# Altium project Monitoring_Control_Circuit.PrjPcb
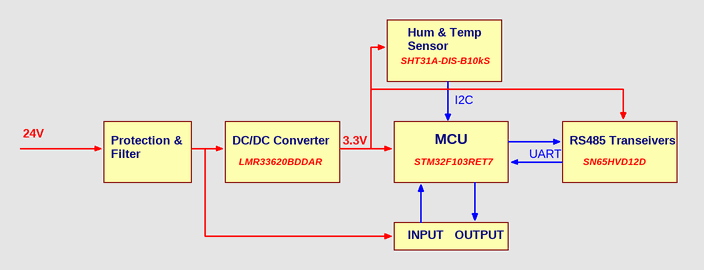
[diagram p0: 00_Diagram.SchDoc]
7 sheets, 118 parts. Net scope: flat (ports and power ports of the same name join across sheets).
Board file: Monitoring_Control_Circuit.PcbDoc
Sheets:
  00_Diagram.SchDoc
  01_MCU.SchDoc
  02_Hum_Temp_Sensor.SchDoc
  03_RS485.SchDoc
  04_ADC.SchDoc
  05_Power.SchDoc
  06_Input_Output.SchDoc

## Sheet 00_Diagram.SchDoc: Block Diagram
size A4; Project_Name: Monitoring_Control_Circuit; Designer: Hao Thai; Version: 1.0

### Notes on the sheet
- Hum & Temp
- SHT31A-DIS-B10kS
- Sensor
- I2C
- 24V
- Protection &
- Filter
- DC/DC Converter
- LMR33620BDDAR
- 3.3V
- STM32F103RET7
- MCU
- UART
- RS485 Transeivers
- SN65HVD12D
- INPUT
- OUTPUT
- Document Title:
- Size:
- Project Name:
- A4
- Designer:
- Reviewer:
- Revision:
- Sheet
- of
- Nguyen Xien Street
- Long Thanh My Ward, Thu Duc District
- Ho Chi Minh City
- Date:
- File:

## Sheet 01_MCU.SchDoc: MCU
size A4; Project_Name: Monitoring_Control_Circuit; Designer: Hao Thai; Version: 1.0
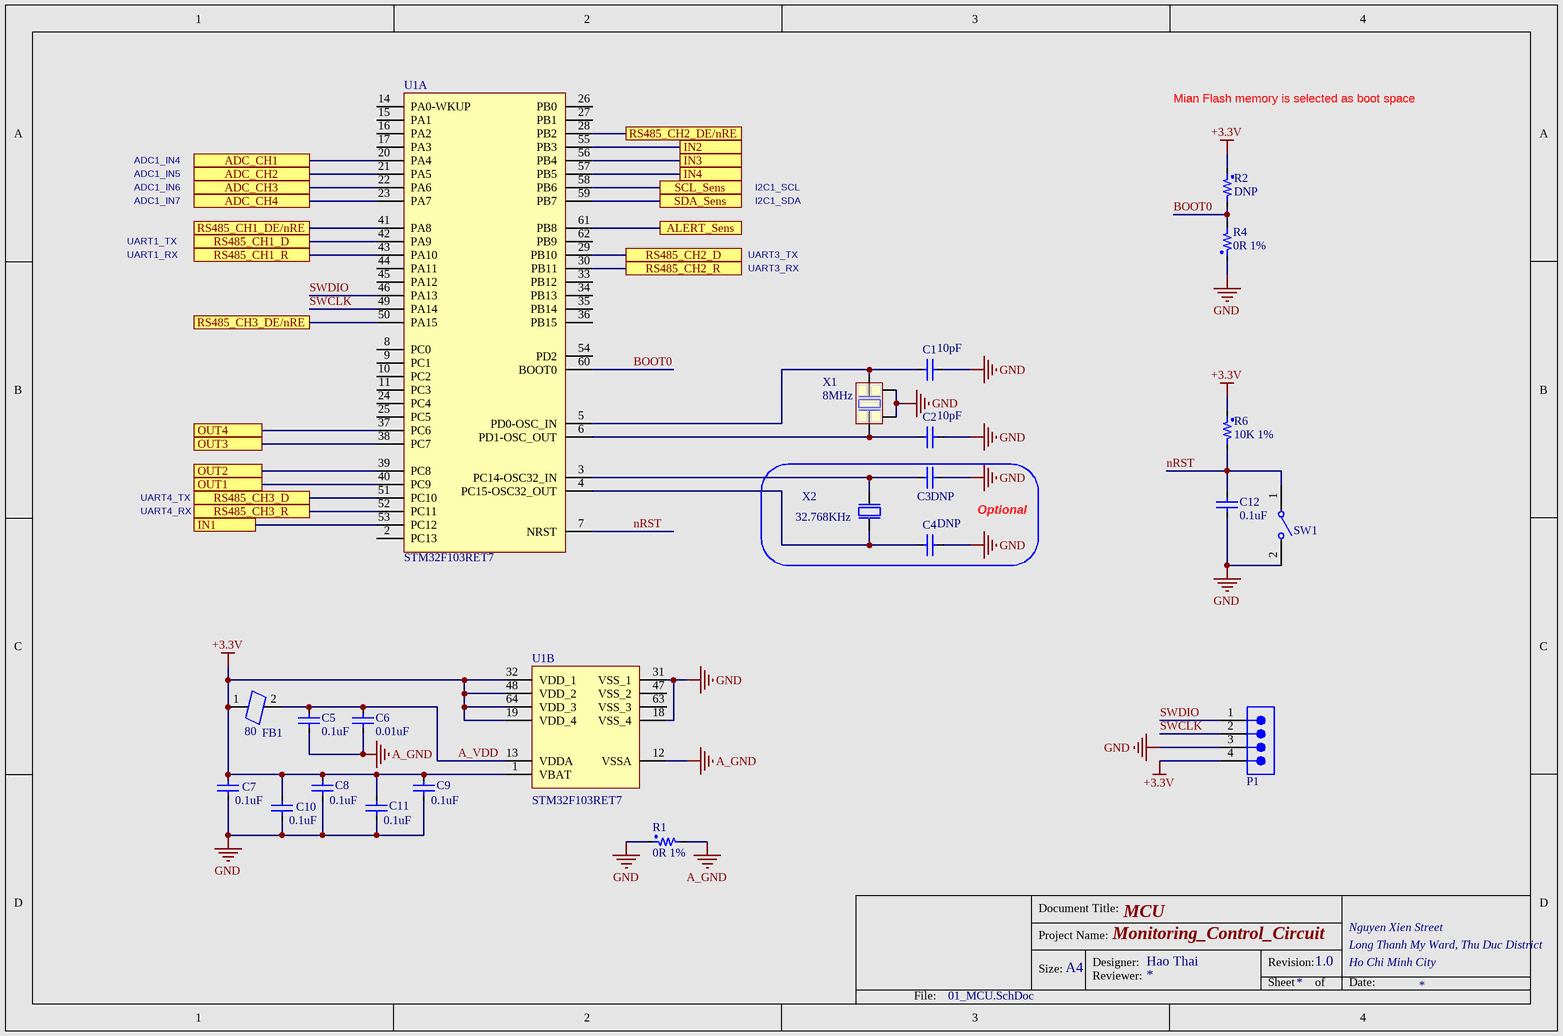
[diagram p1: 01_MCU.SchDoc]

### Parts
C1  10pF  [C0603 (1608 metric)]
C2  10pF  [C0603 (1608 metric)]
C3  DNP  [C0603 (1608 metric)]  (no BOM)
C4  DNP  [C0603 (1608 metric)]  (no BOM)
C5  0.1uF  [C0603 (1608 metric)]
C6  0.01uF  [C0603 (1608 metric)]
C7  0.1uF  [C0603 (1608 metric)]
C8  0.1uF  [C0603 (1608 metric)]
C9  0.1uF  [C0603 (1608 metric)]
C10  0.1uF  [C0603 (1608 metric)]
C11  0.1uF  [C0603 (1608 metric)]
C12  0.1uF  [C0603 (1608 metric)]
FB1  80  [FB0805 (2012 METRIC)]
P1  61300411121  [61300411121]  (value not drawn)
R1  0R 1%  [R0603 (1608 Metric)]
R2  DNP  [R0603 (1608 Metric)]  (no BOM)
R4  0R 1%  [R0603 (1608 Metric)]
R6  10K 1%  [R0603 (1608 Metric)]
SW1  434121025816  [WS-TASV_L6W3.8H2.5_4341x10258x6]  (value not drawn)
U1  STM32F103RET7  [STM-LQFP64_N]  (parts A,B of 2)
X1  8MHz  [TSX_3225]
X2  32.768KHz  [XTAL_3215_2Pin]  (no BOM)

### Blocks framed on the sheet
Optional: C3 C4 X2

### Ports
ADC_CH1, ADC_CH2, ADC_CH3, ADC_CH4, ALERT_Sens, IN1, IN2, IN3, IN4, OUT1, OUT2, OUT3, OUT4, RS485_CH1_D, RS485_CH1_DE/nRE, RS485_CH1_R, RS485_CH2_D, RS485_CH2_DE/nRE, RS485_CH2_R, RS485_CH3_D, RS485_CH3_DE/nRE, RS485_CH3_R, SCL_Sens, SDA_Sens

### Nets
+3.3V: C7.2 C8.2 C9.2 C10.2 C11.2 FB1.1 P1.4 R2.1 R6.1 U1.1(VBAT) U1.19(VDD_4) U1.32(VDD_1) U1.48(VDD_2) U1.64(VDD_3)
A_GND: C5.1 C6.1 R1.2 U1.12(VSSA)
GND: C1.1 C2.1 C3.2 C4.2 C7.1 C8.1 C9.1 C10.1 C11.1 C12.2 P1.3 R1.1 R4.1 SW1.2 U1.18(VSS_4) U1.31(VSS_1) X1.2(GND) X1.4(GND)
A_VDD: C5.2 C6.2 FB1.2 U1.13(VDDA)
ADC_CH1: U1.20(PA4) ; port ADC_CH1
ADC_CH2: U1.21(PA5) ; port ADC_CH2
ADC_CH3: U1.22(PA6) ; port ADC_CH3
ADC_CH4: U1.23(PA7) ; port ADC_CH4
ALERT_Sens: U1.61(PB8) ; port ALERT_Sens
BOOT0: R2.2 R4.2 U1.60(BOOT0)
IN1: U1.53(PC12) ; port IN1
IN2: U1.55(PB3) ; port IN2
IN3: U1.56(PB4) ; port IN3
IN4: U1.57(PB5) ; port IN4
nRST: C12.1 R6.2 SW1.1 U1.7(NRST)
OUT1: U1.40(PC9) ; port OUT1
OUT2: U1.39(PC8) ; port OUT2
OUT3: U1.38(PC7) ; port OUT3
OUT4: U1.37(PC6) ; port OUT4
RS485_CH1_D: U1.42(PA9) ; port RS485_CH1_D
RS485_CH1_DE/nRE: U1.41(PA8) ; port RS485_CH1_DE/nRE
RS485_CH1_R: U1.43(PA10) ; port RS485_CH1_R
RS485_CH2_D: U1.29(PB10) ; port RS485_CH2_D
RS485_CH2_DE/nRE: U1.28(PB2) ; port RS485_CH2_DE/nRE
RS485_CH2_R: U1.30(PB11) ; port RS485_CH2_R
RS485_CH3_D: U1.51(PC10) ; port RS485_CH3_D
RS485_CH3_DE/nRE: U1.50(PA15) ; port RS485_CH3_DE/nRE
RS485_CH3_R: U1.52(PC11) ; port RS485_CH3_R
SCL_Sens: U1.58(PB6) ; port SCL_Sens
SDA_Sens: U1.59(PB7) ; port SDA_Sens
SWCLK: P1.2 U1.49(PA14)
SWDIO: P1.1 U1.46(PA13)
NetC1_2: C1.2 U1.5(PD0-OSC_IN) X1.1(Input)
NetC2_2: C2.2 U1.6(PD1-OSC_OUT) X1.3(Out)
NetC3_1: C3.1 U1.3(PC14-OSC32_IN) X2.2(out)
NetC4_1: C4.1 U1.4(PC15-OSC32_OUT) X2.1(inp)

Not connected (* = marked no-connect by the designer): U1 2(PC13) 8(PC0) 9(PC1) 10(PC2) 11(PC3) 14(PA0-WKUP) 15(PA1) 16(PA2) 17(PA3) 24(PC4) 25(PC5) 26(PB0) 27(PB1) 33(PB12) 34(PB13) 35(PB14) 36(PB15) 44(PA11) 45(PA12) 47(VSS_2) 54(PD2) 62(PB9) 63(VSS_3)

### Notes on the sheet
- Mian Flash memory is selected as boot space
- ADC1_IN4
- ADC1_IN5
- UART1_TX
- ADC1_IN6
- ADC1_IN7
- I2C1_SCL
- I2C1_SDA
- UART1_RX
- UART3_TX
- UART3_RX
- UART4_TX
- UART4_RX
- Document Title:
- Size:
- Project Name:
- A4
- Designer:
- Reviewer:
- Revision:
- Sheet
- of
- Nguyen Xien Street
- Long Thanh My Ward, Thu Duc District
- Ho Chi Minh City
- Date:
- File:

### Library data of the parts
C1 C2 = CC0603JRNPO9BN100: Multilayer Ceramic Capacitors MLCC - SMD/SMT 10pF 250V C0G +/-5% 0603; Mfr: Yageo; Dielectric: C0G (NP0); Voltage: 50V; Tolerance: 5%; Mfr Part Number: CC0603JRNPO9BN100; Supplier Part Number 1: 603-CC603JRNPO9BN100; Supplier 1: Mouser; Value: 10pF; Case: 0603 (1608 metric)
C3 C4 = CC0603JRNPO9BN120: Multilayer Ceramic Capacitors MLCC - SMD/SMT 12pF 250V C0G +/-5% 0603; Mfr: Yageo; Dielectric: C0G (NP0); Voltage: 50V; Tolerance: 5%; Mfr Part Number: CC0603JRNPO9BN120; Supplier Part Number 1: 603-CC603JRNPO9BN120; Supplier 1: Mouser; Value: 12pF; Case: 0603 (1608 metric)
C5 C7-C12 = CC0603KRX7R9BB104: Multilayer Ceramic Capacitors MLCC - SMD/SMT 0.1uF 50V X7R +/-10% 0603; Mfr: Yageo; Tolerance: 10%; Mfr Part Number: CC0603KRX7R9BB104; Supplier Part Number 1: 603-CC603KRX7R9BB104; Supplier 1: Mouser; Value: 0.1uF; Dielectric: X7R; Case: 0603 (1608 metric); Voltage: 50V
C6 = CC0603KRX7R9BB103: Multilayer Ceramic Capacitors MLCC - SMD/SMT 0.01uF 50V X7R +/-10% 0603; Mfr: Yageo; Tolerance: 10%; Mfr Part Number: CC0603KRX7R9BB103; Supplier Part Number 1: 603-CC603KRX7R9BB103; Supplier 1: Mouser; Value: 0.01uF; Dielectric: X7R; Case: 0603 (1608 metric); Voltage: 50V
FB1 = FBMH2012HM800-T: Ferrite Beads HI CUR CHIP BD 0805 80OHMS 25%; Mfr: Taiyo Yuden; Maximum DC Resistance: 25 mOhm; Maximum DC Current: 2.7A; Impedance: 80; Supplier Part Number 1: 963-FBMH2012HM800-T; Mfr Part Number: FBMH2012HM800-T; Supplier 1: Mouser; Tolerance: 25%; Package: 0805 (2012 metric)
P1 = 61300411121: WR-PHD Pin Header, THT, Vertical, pitch 2.54mm, 1 Row, 4P; Mfr: Wurth Elektronik; Contact Resistance: 20mΩ; Rated Current: 3A; Working Voltage: 250V; Withstanding Voltage: 500V; ComponentLink1Description: Website Link; ComponentLink1URL: https://www.we-online.com/redexpert/article/61300411121?ad; ComponentLink2Description: Datasheet Link; ComponentLink2URL: https://www.we-online.com/redexpert/spec/61300411121?ad; Mfr Part Number: 61300411121; Category: Board-to-Board Connectors; Match Code: WR-PHD; Mount: Through Hole; Operating Temperature Max: 105°C; Operating Temperature Min: -40°C; Packaging: Bag; Gender: Pin Header; Number of Pins: 4; Number of Rows: 1; Orientation: Vertical; Pitch: 2.54mm
R1 R4 = RC0603FR-070RL: Thick Film Resistors - SMD 0 OHM 1% Case 0603; Mfr: Yageo; Value: 0R; Supplier 1: Mouser; Supplier Part Number 1: 603-RC0603FR-070RL; Mfr Part Number: RC0603FR-070RL; Case: 0603 (1608 metric); Tolerance: 1%
R2 R6 = RC0603FR-0710KL: Thick Film Resistors - SMD 10K OHM 1% Case 0603; Mfr: Yageo; Value: 10K; Supplier 1: Mouser; Supplier Part Number 1: 603-RC0603FR-0710KL; Mfr Part Number: RC0603FR-0710KL; Case: 0603 (1608 metric); Tolerance: 1%
SW1 = 434121025816: WS-TASV SMT Tact Switch, SPST-NO, 12VDC, 50mA, 160g; Mfr: Wurth Elektronik; Washable: No; ComponentLink1Description: Website Link; ComponentLink1URL: https://www.we-online.com/redexpert/article/434121025816?ad; ComponentLink2Description: Datasheet Link; ComponentLink2URL: https://www.we-online.com/redexpert/spec/434121025816?ad; Mfr Part Number: 434121025816; Category: Tact Switches; Match Code: WS-TASV; Mount: Surface Mount; Operating Temperature Max: 85°C; Operating Temperature Min: -40°C; Packaging: Tape and Reel; Length: 6mm; Width: 3.8mm; Height: 2.5mm; Circuit: SPST-NO; Contact Material: Stainless Steel; Contact Plating: Silver; Operation Force: 160g; Rated Current: 50mA; Rated Voltage: 12VDC; Terminal Material: Copper Alloy; Terminal Plating: Silver
U1 = STM32F103RET7: ARM Cortex-M3 32-bit MCU, 512 KB Flash, 64 KB Internal RAM, 51 I/Os, 64-pin LQFP, -40 to 105 degC, Tray; Mfr: STMicroelectronics; DatasheetVersion: Rev. 8; PackageVersion: Rev. 4, 06/2013; PackageReference: LQFP64; PackageDescription: 64-Pin Low Profile Quad Flat Package, 10 x 10 mm Body, 0.5 mm Pitch; Supplier 1: Mouser; Supplier Part Number 1: 511-STM32F103RET7; ComponentLink1Description: Manufacturer URL; ComponentLink1URL: http://www.st.com/web/en/home.html; ComponentLink2Description: Datasheet; ComponentLink2URL: http://www.st.com/st-web-ui/static/active/en/resource/technical/document/datasheet/CD00191185.pdf; ComponentLink3Description: Package Specification; ComponentLink3URL: http://www.st.com/st-web-ui/static/active/en/resource/technical/document/datasheet/DM00037051.pdf; Mfr Part Number: STM32F103RET7
X1 = ECS-80-10-33-CHN-TR: Crystals CRYSTAL 8.0000MHZ 10PF SMD,ECX-32,+/-10ppm,+/-25ppm,400 Ohm,Fundamental,-40 C 85 C,4-SMD, No Lead; Mfr: ECS; Tolerance: 10 PPM; Frequency Stability: 20ppm; Value: 8MHz; Mfr Part Number: ECS-80-10-33-CHN-TR; Supplier 1: Mouser; Load Capacitance: 10 pF; Supplier Part Number 1: 520-ECS-80-1033CHNTR; Package: 3.2 mm x 2.5 mm
X2 = ECS-.327-12.5-34B-TR: Crystals 32.768KHz 20ppm 12.5pF -40C +85C; Mfr: ECS; Mfr Part Number: ECS-.327-12.5-34B-TR; Pin Count: 2; Value: 32.768KHz; Package: 3.2 mm x 1.5 mm; Supplier 1: Mouser; Supplier Part Number 1: 520-327-12.5-34B; Tolerance: 20 ppm

## Sheet 02_Hum_Temp_Sensor.SchDoc: Hum_Temp_Sensor
size A4; SheetNumber: 3; SheetTotal: 7; Project_Name: Monitoring_Control_Circuit; Designer: Hao Thai; Version: 1.0
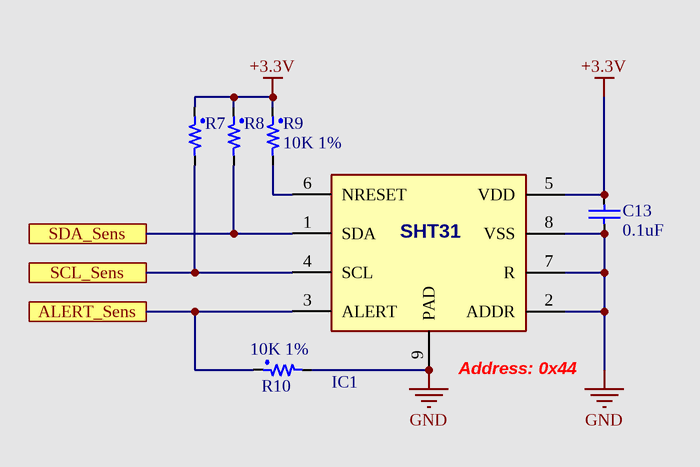
[diagram p2: 02_Hum_Temp_Sensor.SchDoc]

### Parts
C13  0.1uF  [C0603 (1608 metric)]
IC1  SHT31A-DIS-B10kS  [SHT31]  (value not drawn)
R7  10K 1%  [R0603 (1608 Metric)]  (value not drawn)
R8  10K 1%  [R0603 (1608 Metric)]  (value not drawn)
R9  10K 1%  [R0603 (1608 Metric)]
R10  10K 1%  [R0603 (1608 Metric)]

### Ports
ALERT_Sens, SCL_Sens, SDA_Sens

### Nets
+3.3V: C13.2 IC1.5(VDD) R7.1 R8.1 R9.1
GND: C13.1 IC1.2(ADDR) IC1.7(R) IC1.8(VSS) IC1.9(PAD) R10.2
ALERT_Sens: IC1.3(ALERT) R10.1 ; port ALERT_Sens
SCL_Sens: IC1.4(SCL) R7.2 ; port SCL_Sens
SDA_Sens: IC1.1(SDA) R8.2 ; port SDA_Sens
NetIC1_6: IC1.6(NRESET) R9.2

### Notes on the sheet
- (near IC1) Address: 0x44
- Document Title:
- BK Maker Club
- Size:
- Project Name:
- A4
- Designer:
- Reviewer:
- Revision:
- Sheet
- of
- Nguyen Xien Street
- Long Thanh My Ward, Thu Duc District
- Ho Chi Minh City
- Date:
- File:
- (in symbol SHT31A-DIS-B10kS) SHT31

### Library data of the parts
C13 = CC0603KRX7R9BB104: as C5 on sheet 01_MCU; Mfr Part Number: CC0603KRX7R9BB104; Supplier Part Number 1: 603-CC603KRX7R9BB104; Supplier 1: Mouser; Value: 0.1uF; Dielectric: X7R; Case: 0603 (1608 metric); Voltage: 50V
IC1 = SHT31A-DIS-B10kS: Board Mount Humidity Sensors RH/ T Sensor, Automotive certified; Mfr: Sensirion; Datasheet Link: http://www.farnell.com/datasheets/2915263.pdf; Height: 1mm; Mfr Part Number: SHT31A-DIS-B10kS; Supplier Part Number 1: 403-SHT31ADIS-B10KS; Supplier 1: Mouser; Arrow Part Number: SHT31A-DIS-B10KS; Arrow Price/Stock: https://www.arrow.com/en/products/sht31a-dis-b10ks/sensirion-ag?region=nac
R7-R10 = RC0603FR-0710KL: as R2 on sheet 01_MCU; Value: 10K; Supplier 1: Mouser; Supplier Part Number 1: 603-RC0603FR-0710KL; Mfr Part Number: RC0603FR-0710KL; Case: 0603 (1608 metric); Tolerance: 1%

## Sheet 03_RS485.SchDoc: RS485 Interfaces
size A4; SheetNumber: 4; SheetTotal: 7; Project_Name: Monitoring_Control_Circuit; Designer: Hao Thai; Version: 1.0
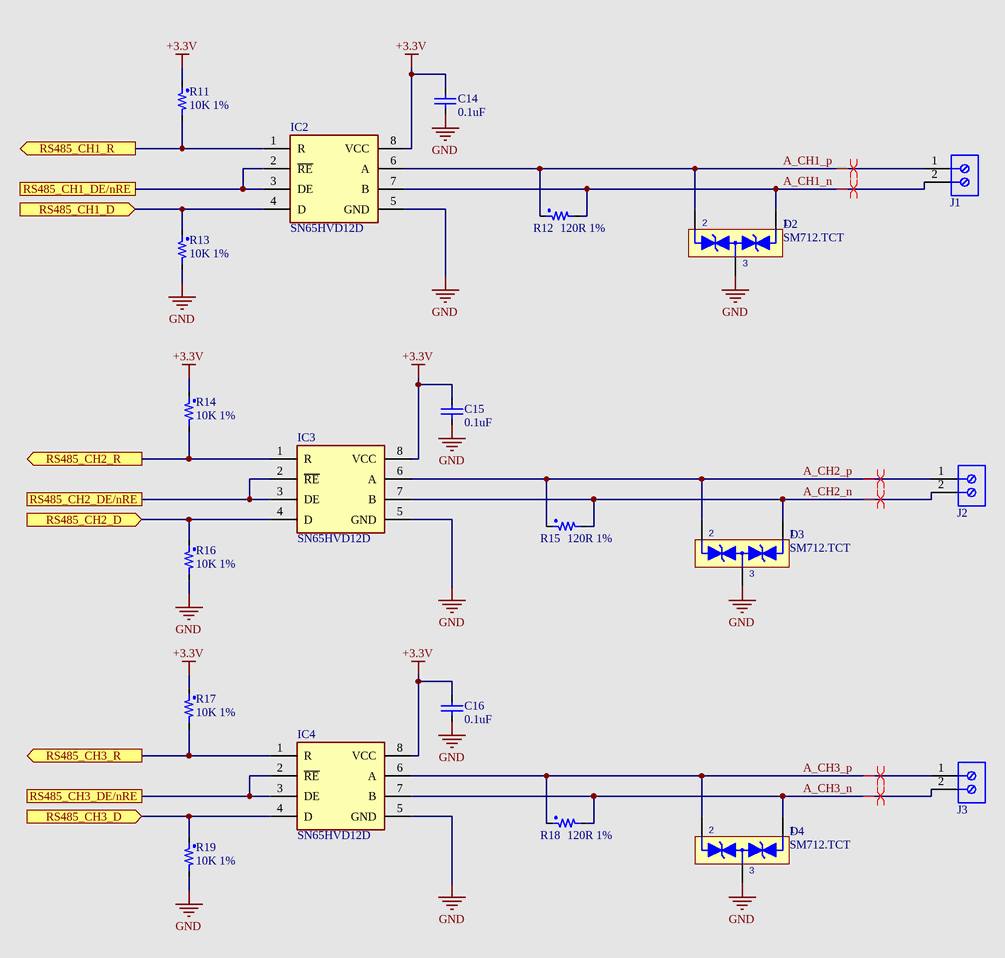
[diagram p3: 03_RS485.SchDoc]

### Parts
C14  0.1uF  [C0603 (1608 metric)]
C15  0.1uF  [C0603 (1608 metric)]
C16  0.1uF  [C0603 (1608 metric)]
D2  SM712.TCT  [SM712]
D3  SM712.TCT  [SM712]
D4  SM712.TCT  [SM712]
IC2  SN65HVD12D  [SOIC8]
IC3  SN65HVD12D  [SOIC8]
IC4  SN65HVD12D  [SOIC8]
J1  691103110002  [691103110002]  (value not drawn)
J2  691103110002  [691103110002]  (value not drawn)
J3  691103110002  [691103110002]  (value not drawn)
R11  10K 1%  [R0603 (1608 Metric)]
R12  120R 1%  [R0805 (2012 METRIC)]
R13  10K 1%  [R0603 (1608 Metric)]
R14  10K 1%  [R0603 (1608 Metric)]
R15  120R 1%  [R0805 (2012 METRIC)]
R16  10K 1%  [R0603 (1608 Metric)]
R17  10K 1%  [R0603 (1608 Metric)]
R18  120R 1%  [R0805 (2012 METRIC)]
R19  10K 1%  [R0603 (1608 Metric)]

### Ports
RS485_CH1_D (in), RS485_CH1_DE/nRE, RS485_CH1_R (out), RS485_CH2_D (in), RS485_CH2_DE/nRE, RS485_CH2_R (out), RS485_CH3_D (in), RS485_CH3_DE/nRE, RS485_CH3_R (out)

### Nets
+3.3V: C14.1 C15.1 C16.1 IC2.8(VCC) IC3.8(VCC) IC4.8(VCC) R11.1 R14.1 R17.1
GND: C14.2 C15.2 C16.2 D2.3(GND) D3.3(GND) D4.3(GND) IC2.5(GND) IC3.5(GND) IC4.5(GND) R13.2 R16.2 R19.2
A_CH1_n: D2.1(I/O1) IC2.7(B) J1.2 R12.2
A_CH1_p: D2.2(I/O2) IC2.6(A) J1.1 R12.1
A_CH2_n: D3.1(I/O1) IC3.7(B) J2.2 R15.2
A_CH2_p: D3.2(I/O2) IC3.6(A) J2.1 R15.1
A_CH3_n: D4.1(I/O1) IC4.7(B) J3.2 R18.2
A_CH3_p: D4.2(I/O2) IC4.6(A) J3.1 R18.1
RS485_CH1_D: IC2.4(D) R13.1 ; port RS485_CH1_D
RS485_CH1_DE/nRE: IC2.2(~{RE}) IC2.3(DE) ; port RS485_CH1_DE/nRE
RS485_CH1_R: IC2.1(R) R11.2 ; port RS485_CH1_R
RS485_CH2_D: IC3.4(D) R16.1 ; port RS485_CH2_D
RS485_CH2_DE/nRE: IC3.2(~{RE}) IC3.3(DE) ; port RS485_CH2_DE/nRE
RS485_CH2_R: IC3.1(R) R14.2 ; port RS485_CH2_R
RS485_CH3_D: IC4.4(D) R19.1 ; port RS485_CH3_D
RS485_CH3_DE/nRE: IC4.2(~{RE}) IC4.3(DE) ; port RS485_CH3_DE/nRE
RS485_CH3_R: IC4.1(R) R17.2 ; port RS485_CH3_R

### Layout directives
differential pair: A_CH1_n, A_CH1_p, A_CH2_n, A_CH2_p, A_CH3_n, A_CH3_p

### Notes on the sheet
- Document Title:
- BK Maker Club
- Size:
- Project Name:
- A4
- Designer:
- Reviewer:
- Revision:
- Sheet
- of
- Nguyen Xien Street
- Long Thanh My Ward, Thu Duc District
- Ho Chi Minh City
- Date:
- File:

### Library data of the parts
C14-C16 = CC0603KRX7R9BB104: as C5 on sheet 01_MCU; Mfr Part Number: CC0603KRX7R9BB104; Supplier Part Number 1: 603-CC603KRX7R9BB104; Supplier 1: Mouser; Value: 0.1uF; Dielectric: X7R; Case: 0603 (1608 metric); Voltage: 50V
D2-D4 = SM712.TCT: ESD Suppressors / TVS Diodes 400W ASYMMETRICAL TVS 7V,12V; Mfr: SEMTECH; Datasheet Link: https://datasheet.datasheetarchive.com/originals/distributors/Datasheets-30/DSA-588511.pdf; Height: 1.12mm; Mfr Part Number: SM712.TCT; Supplier Part Number 1: 947-SM712.TCT; Supplier 1: Mouser; Arrow Part Number: SM712.TCT; Arrow Price/Stock: https://www.arrow.com/en/products/sm712.tct/semtech?region=nac
IC2-IC4 = SN65HVD12D: RS-485 Interface IC 3.3V Differential Transceivers; Mfr: Texas Instruments; Mfr Part Number: SN65HVD12DR; Height: 1.75mm; Supplier Part Number 1: 595-SN65HVD12DR; Supplier 1: Mouser
J1-J3 = 691103110002: WR-TBL Series 1031 Horizontal Entry Modular, THT, pitch 3.5mm, 2p; Mfr: Wurth Elektronik; Modularity: Yes; Rated Current: 10A; Working Voltage: 125V; ComponentLink1Description: Website Link; ComponentLink1URL: https://www.we-online.com/redexpert/article/691103110002?ad; ComponentLink2Description: Datasheet Link; ComponentLink2URL: https://www.we-online.com/redexpert/spec/691103110002?ad; Mfr Part Number: 691103110002; Category: Terminal Blocks; Match Code: WR-TBL; Mount: Through Hole; Operating Temperature Max: 105°C; Operating Temperature Min: -40°C; Packaging: Box; Application: Pressure Clamp; Number of Pins: 2; Number of Rows: 1; Orientation: Horizontal; Pitch: 3.5mm
R11 R13 R14 R16 R17 R19 = RC0603FR-0710KL: as R2 on sheet 01_MCU; Value: 10K; Supplier 1: Mouser; Supplier Part Number 1: 603-RC0603FR-0710KL; Mfr Part Number: RC0603FR-0710KL; Case: 0603 (1608 metric); Tolerance: 1%
R12 R15 R18 = RC0805FR-07120RL: Thick Film Resistors - SMD 120 OHM 1%; Mfr: Yageo; Value: 120R; Supplier 1: Mouser; Supplier Part Number 1: 603-RC0805FR-07120RL; Mfr Part Number: RC0805FR-07120RL; Case: 0805 (2012 metric); Tolerance: 1%

## Sheet 04_ADC.SchDoc: ADC
size A4; SheetNumber: 5; SheetTotal: 7; Project_Name: Monitoring_Control_Circuit; Designer: Hao Thai; Version: 1.0
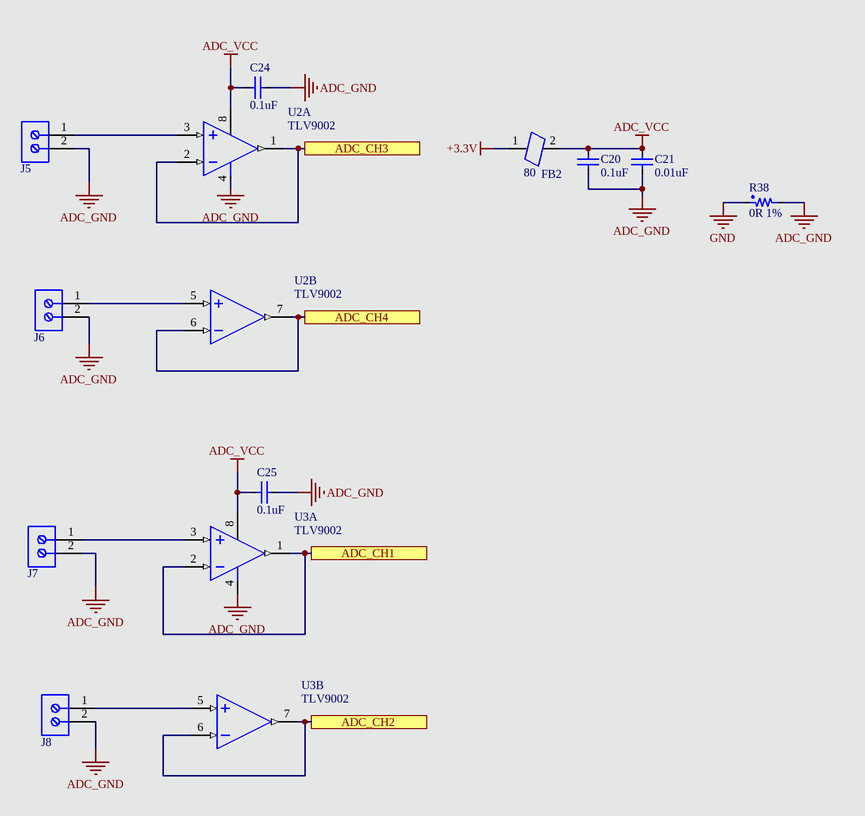
[diagram p4: 04_ADC.SchDoc]

### Parts
C20  0.1uF  [C0603 (1608 metric)]
C21  0.01uF  [C0603 (1608 metric)]
C24  0.1uF  [C0603 (1608 metric)]
C25  0.1uF  [C0603 (1608 metric)]
FB2  80  [FB0805 (2012 METRIC)]
J5  691103110002  [691103110002]  (value not drawn)
J6  691103110002  [691103110002]  (value not drawn)
J7  691103110002  [691103110002]  (value not drawn)
J8  691103110002  [691103110002]  (value not drawn)
R38  0R 1%  [R0603 (1608 Metric)]
U2  TLV9002  [VSSOP-8_DGK]  (parts A,B of 2)
U3  TLV9002  [VSSOP-8_DGK]  (parts A,B of 2)

### Ports
ADC_CH1, ADC_CH2, ADC_CH3, ADC_CH4

### Nets
+3.3V: FB2.1
ADC_GND: C20.1 C21.1 C24.2 C25.2 J5.2 J6.2 J7.2 J8.2 R38.2 U2.4(-V) U3.4(-V)
ADC_VCC: C20.2 C21.2 C24.1 C25.1 FB2.2 U2.8(+V) U3.8(+V)
GND: R38.1
ADC_CH1: U3.1(OUT) U3.2(IN-) ; port ADC_CH1
ADC_CH2: U3.6(IN-) U3.7(OUT) ; port ADC_CH2
ADC_CH3: U2.1(OUT) U2.2(IN-) ; port ADC_CH3
ADC_CH4: U2.6(IN-) U2.7(OUT) ; port ADC_CH4
NetJ5_1: J5.1 U2.3(IN+)
NetJ6_1: J6.1 U2.5(IN+)
NetJ7_1: J7.1 U3.3(IN+)
NetJ8_1: J8.1 U3.5(IN+)

### Notes on the sheet
- Document Title:
- BK Maker Club
- Size:
- Project Name:
- A4
- Designer:
- Reviewer:
- Revision:
- Sheet
- of
- Nguyen Xien Street
- Long Thanh My Ward, Thu Duc District
- Ho Chi Minh City
- Date:
- File:

### Library data of the parts
C20 C24 C25 = CC0603KRX7R9BB104: as C5 on sheet 01_MCU; Mfr Part Number: CC0603KRX7R9BB104; Supplier Part Number 1: 603-CC603KRX7R9BB104; Supplier 1: Mouser; Value: 0.1uF; Dielectric: X7R; Case: 0603 (1608 metric); Voltage: 50V
C21 = CC0603KRX7R9BB103: as C6 on sheet 01_MCU; Mfr Part Number: CC0603KRX7R9BB103; Supplier Part Number 1: 603-CC603KRX7R9BB103; Supplier 1: Mouser; Value: 0.01uF; Dielectric: X7R; Case: 0603 (1608 metric); Voltage: 50V
FB2 = FBMH2012HM800-T: as FB1 on sheet 01_MCU; Impedance: 80; Supplier Part Number 1: 963-FBMH2012HM800-T; Mfr Part Number: FBMH2012HM800-T; Supplier 1: Mouser; Tolerance: 25%; Package: 0805 (2012 metric)
J5-J8 = 691103110002: as J1 on sheet 03_RS485; ComponentLink1Description: Website Link; ComponentLink1URL: https://www.we-online.com/redexpert/article/691103110002?ad; ComponentLink2Description: Datasheet Link; ComponentLink2URL: https://www.we-online.com/redexpert/spec/691103110002?ad; Mfr Part Number: 691103110002; Category: Terminal Blocks; Match Code: WR-TBL; Mount: Through Hole; Operating Temperature Max: 105°C; Operating Temperature Min: -40°C; Packaging: Box; Application: Pressure Clamp; Number of Pins: 2; Number of Rows: 1; Orientation: Horizontal; Pitch: 3.5mm
R38 = RC0603FR-070RL: as R1 on sheet 01_MCU; Value: 0R; Supplier 1: Mouser; Supplier Part Number 1: 603-RC0603FR-070RL; Mfr Part Number: RC0603FR-070RL; Case: 0603 (1608 metric); Tolerance: 1%
U2 U3 = TLV9002IDGKR: General Purpose Amplifier 2 Circuit Rail-to-Rail 8-VSSOP; Mfr: Texas Instruments; Value: TLV9002; Mfr Part Number: TLV9002IDGKR; Supplier 1: Mouser; Supplier Part Number 1: 595-TLV9002IDGKR; Package: 8-TSSOP

## Sheet 05_Power.SchDoc: Power
size A4; SheetNumber: 6; SheetTotal: 7; Project_Name: Monitoring_Control_Circuit; Designer: Hao Thai; Version: 1.0
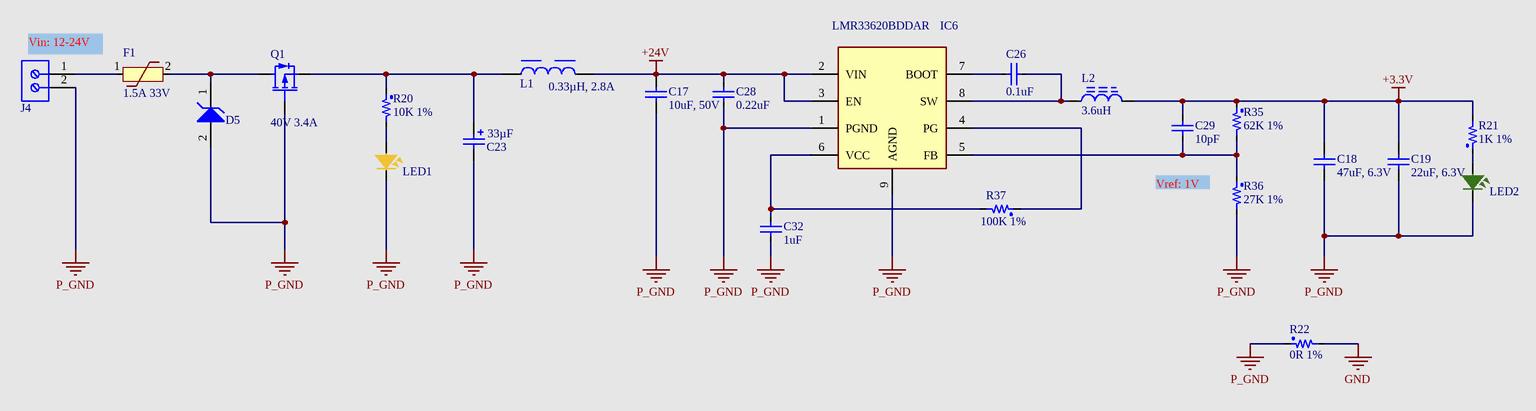
[diagram p5: 05_Power.SchDoc]

### Parts
C17  10uF, 50V  [WCAP-CSGP_1210_H=2.5mm]
C18  47uF, 6.3V  [WCAP-CSGP_1206_H=1.6mm]
C19  22uF, 6.3V  [WCAP-CSGP_1206_H=1.6mm]
C23  33µF  [WCAP-PSLP_D5H5.8]
C26  0.1uF  [C0603 (1608 metric)]
C28  0.22uF  [C0805 (2012 METRIC)]
C29  10pF  [C0603 (1608 metric)]
C32  1uF  [C0603 (1608 metric)]
D5  400W, 26VDC  [WE-TVSP_DO-214AC_Unidirectional]  (value not drawn)
F1  1.5A 33V  [FUSE_2902(7555 metric)]
IC6  LMR33620BDDAR  [SOIC127P600X170-9N]
J4  691103110002  [691103110002]  (value not drawn)
L1  0.33µH, 2.8A  [WE-TPC_2811]
L2  3.6uH  [SRN80408R2Y]
LED1  Yellow  [LED0603_YELLOW]  (value not drawn)
LED2  Green  [LED0603_GREEN]  (value not drawn)
Q1  40V 3.4A  [FET_SOT23-3]
R20  10K 1%  [R0603 (1608 Metric)]
R21  1K 1%  [R0603 (1608 Metric)]
R22  0R 1%  [R0603 (1608 Metric)]
R35  62K 1%  [R0603 (1608 Metric)]
R36  27K 1%  [R0603 (1608 Metric)]
R37  100K 1%  [R0603 (1608 Metric)]

### Nets
+3.3V: C18.2 C19.2 C29.2 L2.2 R21.2 R35.1
+24V: C17.2 C28.1 IC6.2(VIN) IC6.3(EN) L1.2
GND: R22.2
P_GND: C17.1 C18.1 C19.1 C23.2(N) C28.2 C32.1 D5.2(A) IC6.1(PGND) IC6.9(AGND) J4.2 LED1.2 LED2.2 Q1.1(G) R22.1 R36.2
NetC23_1: C23.1(P) L1.1 Q1.2(S) R20.1
NetC26_1: C26.1 IC6.7(BOOT)
NetC26_2: C26.2 IC6.8(SW) L2.1
NetC29_1: C29.1 IC6.5(FB) R35.2 R36.1
NetC32_2: C32.2 IC6.6(VCC) R37.2
NetD5_1: D5.1(K) F1.2 Q1.3(D)
NetF1_1: F1.1 J4.1
NetIC6_4: IC6.4(PG) R37.1
NetLED1_1: LED1.1 R20.2
NetLED2_1: LED2.1 R21.1

### Notes on the sheet
- Vin: 12-24V
- Vref: 1V
- Document Title:
- BK Maker Club
- Size:
- Project Name:
- A4
- Designer:
- Reviewer:
- Revision:
- Sheet
- of
- Nguyen Xien Street
- Long Thanh My Ward, Thu Duc District
- Ho Chi Minh City
- Date:
- File:

### Library data of the parts
C17 = 885012209073: WCAP-CSGP Multilayer Ceramic Chip Capacitor, General Purpose, size 1210, X7R, 10uF, 50V; Mfr: Wurth Elektronik; Rated Voltage: 50VDC; Isolation Resistance: >=0.01GOhm; Capacitance Tolerance: +/-10%; Technical Reference: X7R1210106K050DFCT10000; ComponentLink1Description: Manufacturer; ComponentLink1URL: http://www.we-online.de; ComponentLink2Description: Datasheet; ComponentLink2URL: https://www.we-online.com/catalog/datasheet/885012209073.pdf; Operating Temperature: -55 to +125degC; Packaging: Tape and Reel; Mfr Part Number: 885012209073; Published Date: May 2020; Ceramic Type: X7R; Dissipation Factor: =<10%; Height: 2.5mm; Mounting Technology: SMT; Size: 1210; Capacitance: 10uF
C18 = 885012108004: WCAP-CSGP Multilayer Ceramic Chip Capacitor, General Purpose, size 1206, X5R, 47uF, 6.3V; Mfr: Wurth Elektronik; Rated Voltage: 6.3VDC; Isolation Resistance: >=0.002GOhm; Capacitance Tolerance: +/-20%; Technical Reference: X5R1206476M6R3DFCT10000; ComponentLink1Description: Manufacturer; ComponentLink1URL: http://www.we-online.de; ComponentLink2Description: Datasheet; ComponentLink2URL: https://www.we-online.com/catalog/datasheet/885012108004.pdf; Operating Temperature: -55 to +85degC; Packaging: Tape and Reel; Mfr Part Number: 885012108004; Published Date: May 2020; Ceramic Type: X5R; Dissipation Factor: =<10%; Height: 1.6mm; Mounting Technology: SMT; Size: 1206; Capacitance: 47uF
C19 = 885012108003: WCAP-CSGP Multilayer Ceramic Chip Capacitor, General Purpose, size 1206, X5R, 22uF, 6.3V; Mfr: Wurth Elektronik; Rated Voltage: 6.3VDC; Isolation Resistance: >=0.002GOhm; Capacitance Tolerance: +/-20%; Technical Reference: X5R1206226M6R3DFCT10000; ComponentLink1Description: Manufacturer; ComponentLink1URL: http://www.we-online.de; ComponentLink2Description: Datasheet; ComponentLink2URL: https://www.we-online.com/catalog/datasheet/885012108003.pdf; Operating Temperature: -55 to +85degC; Packaging: Tape and Reel; Mfr Part Number: 885012108003; Published Date: May 2020; Ceramic Type: X5R; Dissipation Factor: =<10%; Height: 1.6mm; Mounting Technology: SMT; Size: 1206; Capacitance: 22uF
C23 = 875105359004: WCAP-PSLP Aluminum Polymer Capacitor, V-Chip SMT, D5 x H5.8mm, 33µF, 16V; Mfr: Wurth Elektronik; Capacitance Tolerance: +/-20%; Dissipation Factor: 8%; Endurance: 2000h; ESR: 30mΩ; Leakage Current: 400µA; Ripple Current: 2200mA; Technical Reference: PSEC058330M016DVCTBB000; ComponentLink1Description: Website Link; ComponentLink1URL: https://www.we-online.com/redexpert/article/875105359004?ad; ComponentLink2Description: Datasheet Link; ComponentLink2URL: https://www.we-online.com/redexpert/spec/875105359004?ad; Mfr Part Number: 875105359004; Category: Aluminum Polymer Capacitors; Match Code: WCAP-PSLP; Mount: Surface Mount; Operating Temperature Max: 105°C; Operating Temperature Min: -55°C; Packaging: Tape and Reel; Height: 5.8mm; Diameter: 5mm; Capacitance: 33µF; Rated Voltage (DC): 16V
C26 = CC0603KRX7R9BB104: as C5 on sheet 01_MCU; Mfr Part Number: CC0603KRX7R9BB104; Supplier Part Number 1: 603-CC603KRX7R9BB104; Supplier 1: Mouser; Value: 0.1uF; Dielectric: X7R; Case: 0603 (1608 metric); Voltage: 50V
C28 = UMK212B7224KG-T: Multilayer Ceramic Capacitors MLCC - SMD/SMT 0805 50VDC 0.22uF 10% X7R; Mfr: Taiyo Yuden; Voltage: 50V; Mfr Part Number: UMK212B7224KG-T; Supplier Part Number 1: 963-UMK212B7224KG-T; Supplier 1: Mouser; Value: 0.22uF; Dielectric: X7R; Case: 0805 (2012 metric); Tolerance: 10%
C29 = CC0603JRNPO9BN100: as C1 on sheet 01_MCU; Mfr Part Number: CC0603JRNPO9BN100; Supplier Part Number 1: 603-CC603JRNPO9BN100; Supplier 1: Mouser; Value: 10pF; Case: 0603 (1608 metric)
C32 = CC0603KRX7R7BB105: Multilayer Ceramic Capacitors MLCC - SMD/SMT 1.0uF 16V X7R +/-10% 0603; Mfr: Yageo; Tolerance: 10%; Mfr Part Number: CC0603KRX7R7BB105; Supplier Part Number 1: 603-CC603KRX7R7BB105; Supplier 1: Mouser; Value: 1uF; Dielectric: X7R; Case: 0603 (1608 metric); Voltage: 16V
D5 = 824500261: WE-TVSP SMT Power TVS Diode, DO-214AC, Unidirectional, 400W, 26VDC; Mfr: Wurth Elektronik; Clamping Voltage: 42.1V; Operating Voltage (DC): 26V; (Reverse) Breakdown Voltage: 30.4V; (Reverse) Peak Pulse Current: 9.5A; ComponentLink1Description: Website Link; ComponentLink1URL: https://www.we-online.com/redexpert/article/824500261?ad; ComponentLink2Description: Datasheet Link; ComponentLink2URL: https://www.we-online.com/redexpert/spec/824500261?ad; Mfr Part Number: 824500261; Category: Surge Protection; Match Code: WE-TVSP; Mount: Surface Mount; Operating Temperature Max: 150°C; Operating Temperature Min: -65°C; Packaging: Tape and Reel; Case/Size Code: DO-214AC; Length: 4.24mm; Width: 2.67mm; Height: 2.25mm; Polarity: Unidirectional; Power Dissipation: 400W
F1 = 0ZCF0150FF2C: Resettable Fuses - PPTC Fuse; Mfr: Bel Fuse; Hold Current: 1.5; Trip Current: 3A; Supplier 1: Mouser; Mfr Part Number: 0ZCF0150FF2C; Supplier Part Number 1: 530-0ZCF0150FF2C; Value: 1.5A 33V; Maximum Voltage: 33V; Package: 2920 (7555 metric)
IC6 = LMR33620BDDAR: Buck Switching Regulator IC Positive Adjustable 1V 1 Output 2A 8-PowerSOIC (0.154", 3.90mm Width); Mfr: Texas Instruments; Datasheet Link: http://www.ti.com/lit/gpn/lmr33620; Height: 1.7mm; Mfr Part Number: LMR33620BDDAR; Supplier Part Number 1: 595-LMR33620BDDAR; Supplier 1: Mouser; Arrow Part Number: LMR33620BDDAR; Arrow Price/Stock: https://www.arrow.com/en/products/lmr33620bddar/texas-instruments
J4 = 691103110002: as J1 on sheet 03_RS485; ComponentLink1Description: Website Link; ComponentLink1URL: https://www.we-online.com/redexpert/article/691103110002?ad; ComponentLink2Description: Datasheet Link; ComponentLink2URL: https://www.we-online.com/redexpert/spec/691103110002?ad; Mfr Part Number: 691103110002; Category: Terminal Blocks; Match Code: WR-TBL; Mount: Through Hole; Operating Temperature Max: 105°C; Operating Temperature Min: -40°C; Packaging: Box; Application: Pressure Clamp; Number of Pins: 2; Number of Rows: 1; Orientation: Horizontal; Pitch: 3.5mm
L1 = 74402800033: WE-TPC SMT Tiny Power Inductor, 2811, 0.33µH, 2.8A, 35mΩ; Mfr: Wurth Elektronik; Case/Size Code: 2811; DC Resistance: 27mΩ; Saturation Current: 2.4A; Self Resonant Frequency: 550MHz; ComponentLink1Description: Website Link; ComponentLink1URL: https://www.we-online.com/redexpert/article/74402800033?ad; ComponentLink2Description: Datasheet Link; ComponentLink2URL: https://www.we-online.com/redexpert/spec/74402800033?ad; Mfr Part Number: 74402800033; Category: Shielded Power Inductors; Match Code: WE-TPC; Mount: Surface Mount; Operating Temperature Max: 125°C; Operating Temperature Min: -40°C; Packaging: Tape and Reel; Length: 2.78mm; Width: 2.78mm; Height: 1.1mm; DC Resistance Max: 35mΩ; Inductance: 0.33µH; Rated Current: 2.8A
L2 = SRN8040-3R6Y: Fixed Inductors 3.6uH 30% SMD 8040; Mfr: Bourns; Maximum DC Current: 4.9 A; Maximum DC Resistance: 22 mOhms; Value: 3.6uH; Mfr Part Number: SRN8040-3R6Y; Supplier 1: Mouser; Supplier Part Number 1: 652-SRN8040-3R6Y; Package: 8 mm x 8 mm
LED1 = LTST-C190YKT: Standard LEDs - SMD 0603 Yellow Clear 588nm; Mfr: Lite-On; Vf - Forward Voltage: 2.1 V; If - Forward Current: 20mA; Illumination Color: Yellow 588 nm; Supplier 1: Mouser; Mfr Part Number: LTST-C190YKT; Supplier Part Number 1: 859-LTST-C190YKT; Package: 0603 (1608 metric)
LED2 = LTST-C191GKT: Standard LEDs - SMD 0603 Green Clear 569nm; Mfr: Lite-On; Vf - Forward Voltage: 2.1 V; If - Forward Current: 20mA; Illumination Color: Green 569 nm; Supplier 1: Mouser; Mfr Part Number: LTST-C191GKT; Supplier Part Number 1: 859-LTST-C191GKT; Package: 0603 (1608 metric)
Q1 = DMP4065SQ-13: MOSFET MOSFET BVDSS: 31V-40V; Mfr: Diodes Incorporated; Gate-to-Source Voltage: +/-25V; Mfr Part Number: DMP4065SQ-13; Supplier Part Number 1: 621-DMP4065SQ-13; Supplier 1: Mouser; Value: 40V 3.4A
R20 = RC0603FR-0710KL: as R2 on sheet 01_MCU; Value: 10K; Supplier 1: Mouser; Supplier Part Number 1: 603-RC0603FR-0710KL; Mfr Part Number: RC0603FR-0710KL; Case: 0603 (1608 metric); Tolerance: 1%
R21 = RC0603FR-071KL: Thick Film Resistors - SMD 1K OHM 1% Case 0603; Mfr: Yageo; Value: 1K; Supplier 1: Mouser; Supplier Part Number 1: 603-RC0603FR-071KL; Mfr Part Number: RC0603FR-071KL; Case: 0603 (1608 metric); Tolerance: 1%
R22 = RC0603FR-070RL: as R1 on sheet 01_MCU; Value: 0R; Supplier 1: Mouser; Supplier Part Number 1: 603-RC0603FR-070RL; Mfr Part Number: RC0603FR-070RL; Case: 0603 (1608 metric); Tolerance: 1%
R35 = RC0603FR-0762KL: Thick Film Resistors - SMD 62 kOhms 100mW 0603 1%; Mfr: Yageo; Value: 62K; Supplier 1: Mouser; Supplier Part Number 1: 603-RC0603FR-072K2L; Mfr Part Number: RC0603FR-0762KL; Case: 0603 (1608 metric); Tolerance: 1%
R36 = RC0603FR-0727KL: Thick Film Resistors - SMD 27K OHM 1% Case 0603; Mfr: Yageo; Value: 27K; Supplier 1: Mouser; Supplier Part Number 1: 603-RC0603FR-0727KL; Mfr Part Number: RC0603FR-0727KL; Case: 0603 (1608 metric); Tolerance: 1%
R37 = RC0603FR-07100KL: Thick Film Resistors - SMD 100K OHM 1% Case 0603; Mfr: Yageo; Value: 100K; Supplier 1: Mouser; Supplier Part Number 1: 603-RC0603FR-07100KL; Mfr Part Number: RC0603FR-07100KL; Case: 0603 (1608 metric); Tolerance: 1%

## Sheet 06_Input_Output.SchDoc: Input_Output
size A4; SheetNumber: 7; SheetTotal: 7; Project_Name: Monitoring_Control_Circuit; Version: 1.0
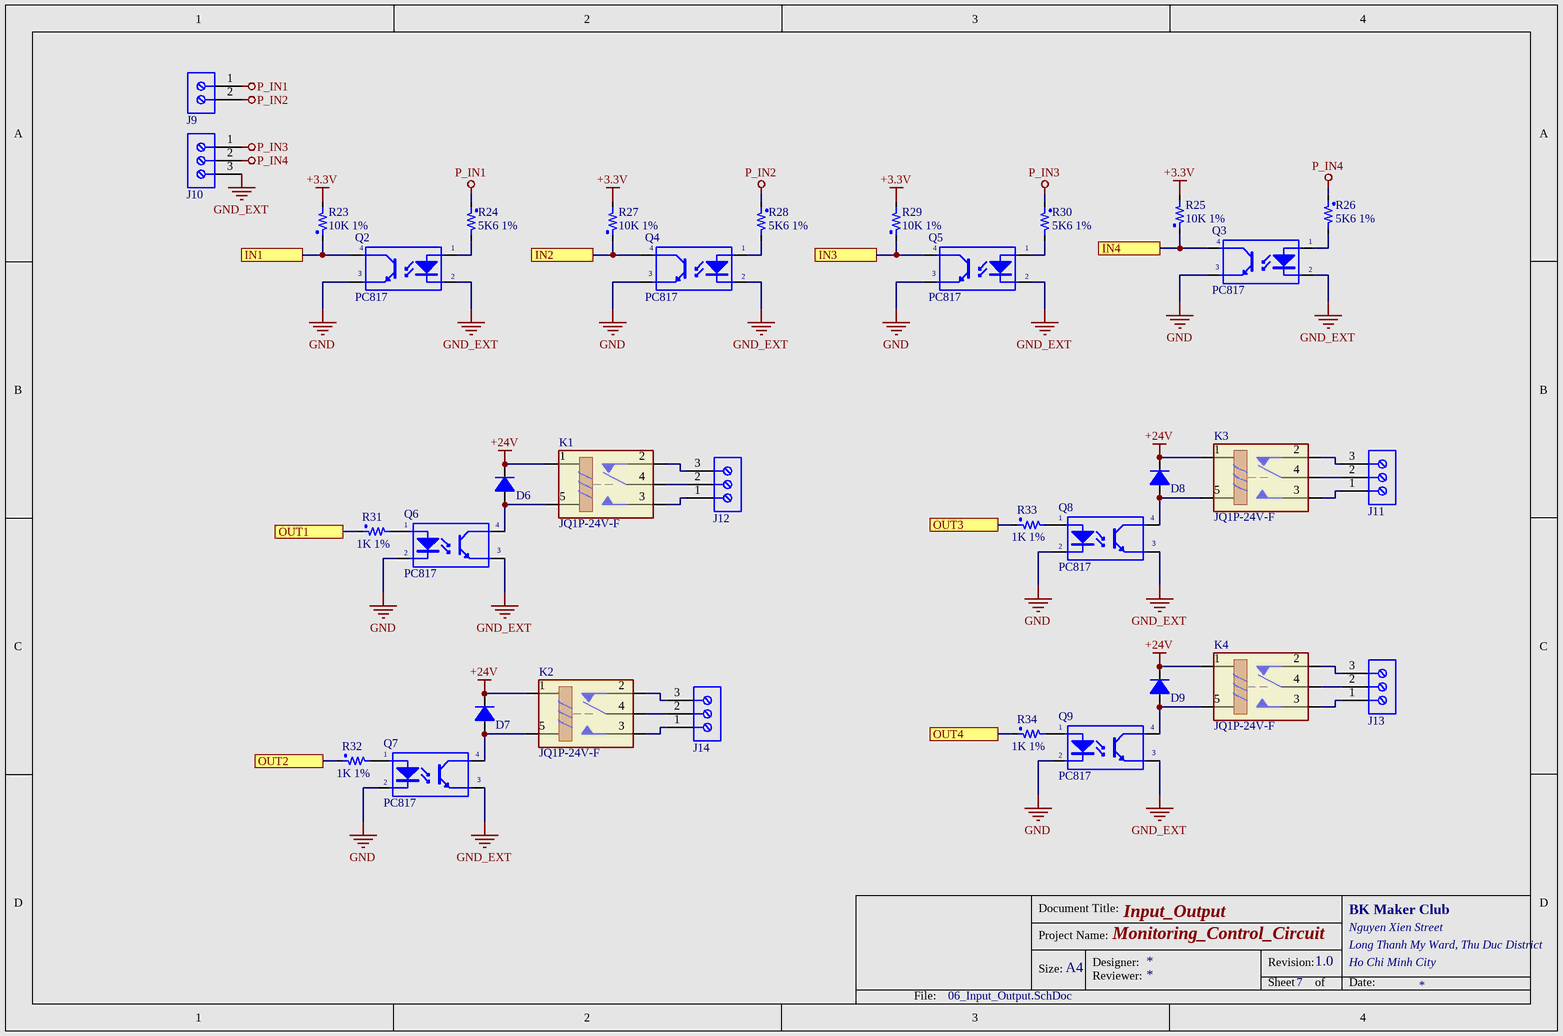
[diagram p6: 06_Input_Output.SchDoc]

### Parts
D6  S1M  [DO-214AC]  (value not drawn)
D7  S1M  [DO-214AC]  (value not drawn)
D8  S1M  [DO-214AC]  (value not drawn)
D9  S1M  [DO-214AC]  (value not drawn)
J9  691103110002  [691103110002]  (value not drawn)
J10  691103110003  [691103110003]  (value not drawn)
J11  691103110003  [691103110003]  (value not drawn)
J12  691103110003  [691103110003]  (value not drawn)
J13  691103110003  [691103110003]  (value not drawn)
J14  691103110003  [691103110003]  (value not drawn)
K1  JQ1P-24V-F  [JQ1P24VF]
K2  JQ1P-24V-F  [JQ1P24VF]
K3  JQ1P-24V-F  [JQ1P24VF]
K4  JQ1P-24V-F  [JQ1P24VF]
Q2  PC817  [SOP-4]
Q3  PC817  [SOP-4]
Q4  PC817  [SOP-4]
Q5  PC817  [SOP-4]
Q6  PC817  [SOP-4]
Q7  PC817  [SOP-4]
Q8  PC817  [SOP-4]
Q9  PC817  [SOP-4]
R23  10K 1%  [R0603 (1608 Metric)]
R24  5K6 1%  [R0603 (1608 Metric)]
R25  10K 1%  [R0603 (1608 Metric)]
R26  5K6 1%  [R0603 (1608 Metric)]
R27  10K 1%  [R0603 (1608 Metric)]
R28  5K6 1%  [R0603 (1608 Metric)]
R29  10K 1%  [R0603 (1608 Metric)]
R30  5K6 1%  [R0603 (1608 Metric)]
R31  1K 1%  [R0603 (1608 Metric)]
R32  1K 1%  [R0603 (1608 Metric)]
R33  1K 1%  [R0603 (1608 Metric)]
R34  1K 1%  [R0603 (1608 Metric)]

### Ports
IN1, IN2, IN3, IN4, OUT1, OUT2, OUT3, OUT4

### Nets
+3.3V: R23.2 R25.2 R27.2 R29.2
+24V: D6.2(K) D7.2(K) D8.2(K) D9.2(K) K1.1(COIL1) K2.1(COIL1) K3.1(COIL1) K4.1(COIL1)
GND: Q2.3(E) Q3.3(E) Q4.3(E) Q5.3(E) Q6.2(K) Q7.2(K) Q8.2(K) Q9.2(K)
GND_EXT: J10.3 Q2.2(K) Q3.2(K) Q4.2(K) Q5.2(K) Q6.3(E) Q7.3(E) Q8.3(E) Q9.3(E)
P_IN1: J9.1 R24.1
P_IN2: J9.2 R28.1
P_IN3: J10.1 R30.1
P_IN4: J10.2 R26.1
IN1: Q2.4(C) R23.1 ; port IN1
IN2: Q4.4(C) R27.1 ; port IN2
IN3: Q5.4(C) R29.1 ; port IN3
IN4: Q3.4(C) R25.1 ; port IN4
OUT1: R31.1 ; port OUT1
OUT2: R32.1 ; port OUT2
OUT3: R33.1 ; port OUT3
OUT4: R34.1 ; port OUT4
NetD6_1: D6.1(A) K1.5(COIL2) Q6.4(C)
NetD7_1: D7.1(A) K2.5(COIL2) Q7.4(C)
NetD8_1: D8.1(A) K3.5(COIL2) Q8.4(C)
NetD9_1: D9.1(A) K4.5(COIL2) Q9.4(C)
NetJ11_1: J11.1 K3.3(NO)
NetJ11_2: J11.2 K3.4(COM)
NetJ11_3: J11.3 K3.2(NC)
NetJ12_1: J12.1 K1.3(NO)
NetJ12_2: J12.2 K1.4(COM)
NetJ12_3: J12.3 K1.2(NC)
NetJ13_1: J13.1 K4.3(NO)
NetJ13_2: J13.2 K4.4(COM)
NetJ13_3: J13.3 K4.2(NC)
NetJ14_1: J14.1 K2.3(NO)
NetJ14_2: J14.2 K2.4(COM)
NetJ14_3: J14.3 K2.2(NC)
NetQ2_1: Q2.1(A) R24.2
NetQ3_1: Q3.1(A) R26.2
NetQ4_1: Q4.1(A) R28.2
NetQ5_1: Q5.1(A) R30.2
NetQ6_1: Q6.1(A) R31.2
NetQ7_1: Q7.1(A) R32.2
NetQ8_1: Q8.1(A) R33.2
NetQ9_1: Q9.1(A) R34.2

### Notes on the sheet
- Document Title:
- BK Maker Club
- Size:
- Project Name:
- A4
- Designer:
- Reviewer:
- Revision:
- Sheet
- of
- Nguyen Xien Street
- Long Thanh My Ward, Thu Duc District
- Ho Chi Minh City
- Date:
- File:

### Library data of the parts
D6-D9 = S1M: Rectifiers 1.0A 1000V; Mfr: ON Semiconductor / Fairchild; Forward Current: 1A; Mfr Part Number: S1M; Supplier Part Number 1: 512-S1M; Supplier 1: Mouser; Package: DO-214AC; Reverse Voltage: 1000V
J9 = 691103110002: as J1 on sheet 03_RS485; ComponentLink1Description: Website Link; ComponentLink1URL: https://www.we-online.com/redexpert/article/691103110002?ad; ComponentLink2Description: Datasheet Link; ComponentLink2URL: https://www.we-online.com/redexpert/spec/691103110002?ad; Mfr Part Number: 691103110002; Category: Terminal Blocks; Match Code: WR-TBL; Mount: Through Hole; Operating Temperature Max: 105°C; Operating Temperature Min: -40°C; Packaging: Box; Application: Pressure Clamp; Number of Pins: 2; Number of Rows: 1; Orientation: Horizontal; Pitch: 3.5mm
J10-J14 = 691103110003: WR-TBL Series 1031 Horizontal Entry Modular, THT, pitch 3.5mm, 3p; Mfr: Wurth Elektronik; Modularity: Yes; Rated Current: 10A; Working Voltage: 125V; ComponentLink1Description: Website Link; ComponentLink1URL: https://www.we-online.com/redexpert/article/691103110003?ad; ComponentLink2Description: Datasheet Link; ComponentLink2URL: https://www.we-online.com/redexpert/spec/691103110003?ad; Mfr Part Number: 691103110003; Category: Terminal Blocks; Match Code: WR-TBL; Mount: Through Hole; Operating Temperature Max: 105°C; Operating Temperature Min: -40°C; Packaging: Box; Application: Pressure Clamp; Number of Pins: 3; Number of Rows: 1; Orientation: Horizontal; Pitch: 3.5mm
K1-K4 = JQ1P-24V-F: Relay or Contactor; Mfr: Panasonic; Datasheet Link: https://www3.panasonic.biz/ac/e_download/control/relay/power/catalog/mech_eng_jq.pdf; Height: 16mm; Mfr Part Number: JQ1P-24V-F; Supplier Part Number 1: 769-JQ1P-24V-F; Supplier 1: Mouser
Q2-Q9 = PC817XNNIP1B: Transistor Output Optocouplers Photocoupler; Mfr: Sharp Microelectronics; Value: PC817; Mfr Part Number: PC817XNNIP1B; Supplier 1: Mouser; Supplier Part Number 1: 852-PC817XNNIP1B; Parameter 5: *
R23 R25 R27 R29 = RC0603FR-0710KL: as R2 on sheet 01_MCU; Value: 10K; Supplier 1: Mouser; Supplier Part Number 1: 603-RC0603FR-0710KL; Mfr Part Number: RC0603FR-0710KL; Case: 0603 (1608 metric); Tolerance: 1%
R24 R26 R28 R30 = RC0603FR-075K6L: Thick Film Resistors - SMD 5K6 OHM 1% Case 0603; Mfr: Yageo; Value: 5K6; Supplier 1: Mouser; Supplier Part Number 1: 603-RC0603FR-075K6L; Mfr Part Number: RC0603FR-075K6L; Case: 0603 (1608 metric); Tolerance: 1%
R31-R34 = RC0603FR-071KL: as R21 on sheet 05_Power; Value: 1K; Supplier 1: Mouser; Supplier Part Number 1: 603-RC0603FR-071KL; Mfr Part Number: RC0603FR-071KL; Case: 0603 (1608 metric); Tolerance: 1%

## Nets that join several sheets
+3.3V: 01_MCU (14 pins), 02_Hum_Temp_Sensor (5 pins), 03_RS485 (9 pins), 04_ADC (FB2.1), 05_Power (6 pins), 06_Input_Output (R23.2 R25.2 R27.2 R29.2)
+24V: 05_Power (5 pins), 06_Input_Output (8 pins)
GND: 01_MCU (18 pins), 02_Hum_Temp_Sensor (6 pins), 03_RS485 (12 pins), 04_ADC (R38.1), 05_Power (R22.2), 06_Input_Output (8 pins)
ADC_CH1: 01_MCU (U1.20), 04_ADC (U3.1 U3.2)
ADC_CH2: 01_MCU (U1.21), 04_ADC (U3.6 U3.7)
ADC_CH3: 01_MCU (U1.22), 04_ADC (U2.1 U2.2)
ADC_CH4: 01_MCU (U1.23), 04_ADC (U2.6 U2.7)
ALERT_Sens: 01_MCU (U1.61), 02_Hum_Temp_Sensor (IC1.3 R10.1)
IN1: 01_MCU (U1.53), 06_Input_Output (Q2.4 R23.1)
IN2: 01_MCU (U1.55), 06_Input_Output (Q4.4 R27.1)
IN3: 01_MCU (U1.56), 06_Input_Output (Q5.4 R29.1)
IN4: 01_MCU (U1.57), 06_Input_Output (Q3.4 R25.1)
OUT1: 01_MCU (U1.40), 06_Input_Output (R31.1)
OUT2: 01_MCU (U1.39), 06_Input_Output (R32.1)
OUT3: 01_MCU (U1.38), 06_Input_Output (R33.1)
OUT4: 01_MCU (U1.37), 06_Input_Output (R34.1)
RS485_CH1_D: 01_MCU (U1.42), 03_RS485 (IC2.4 R13.1)
RS485_CH1_DE/nRE: 01_MCU (U1.41), 03_RS485 (IC2.2 IC2.3)
RS485_CH1_R: 01_MCU (U1.43), 03_RS485 (IC2.1 R11.2)
RS485_CH2_D: 01_MCU (U1.29), 03_RS485 (IC3.4 R16.1)
RS485_CH2_DE/nRE: 01_MCU (U1.28), 03_RS485 (IC3.2 IC3.3)
RS485_CH2_R: 01_MCU (U1.30), 03_RS485 (IC3.1 R14.2)
RS485_CH3_D: 01_MCU (U1.51), 03_RS485 (IC4.4 R19.1)
RS485_CH3_DE/nRE: 01_MCU (U1.50), 03_RS485 (IC4.2 IC4.3)
RS485_CH3_R: 01_MCU (U1.52), 03_RS485 (IC4.1 R17.2)
SCL_Sens: 01_MCU (U1.58), 02_Hum_Temp_Sensor (IC1.4 R7.2)
SDA_Sens: 01_MCU (U1.59), 02_Hum_Temp_Sensor (IC1.1 R8.2)